# Altium schematic sheet Relay_Interface.SchDoc
size A3; DocumentNumber: 7; SheetNumber: 7; SheetTotal: 11
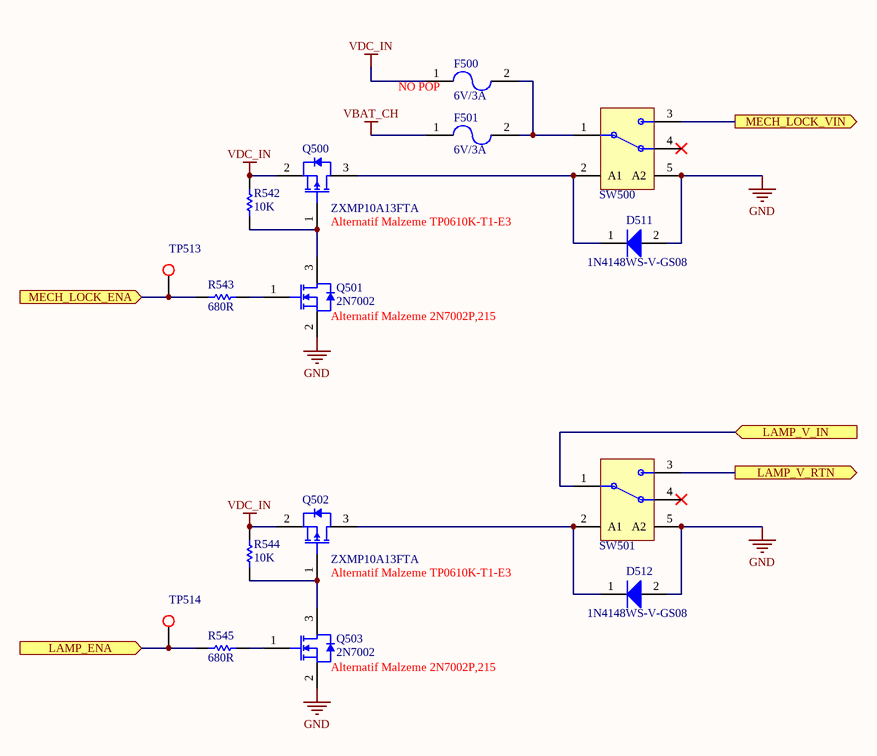
[diagram p0: Relay_Interface.SchDoc]

## Parts
D511  1N4148WS-V-GS08  [SOD65P270X115-2N]
D512  1N4148WS-V-GS08  [SOD65P270X115-2N]
F500  Assembly: NO POP  [AE12-000L-S000-9300]  (hidden comment: 6V/3A)
F501  6V/3A  [AE12-000L-S000-9300]
Q500  ZXMP10A13FTA  [SOT95P230X110-3N]
Q501  2N7002  [SOT90P247X115-3N]
Q502  ZXMP10A13FTA  [SOT95P230X110-3N]
Q503  2N7002  [SOT90P247X115-3N]
R542  10K  [RESC2012X07N]
R543  680R  [RESC1005X04N]
R544  10K  [RESC2012X07N]
R545  680R  [RESC1005X04N]
SW500  Relay  [AE11-0100-T000-0100]  (value not drawn)
SW501  Relay  [AE11-0100-T000-0100]  (value not drawn)
TP513  AEMT-C00S-1000-0000  [TP100]  (value not drawn)
TP514  AEMT-C00S-1000-0000  [TP100]  (value not drawn)

## Ports
LAMP_ENA (in), LAMP_V_IN (in), LAMP_V_RTN (out), MECH_LOCK_ENA (in), MECH_LOCK_VIN (out)

## Nets
GND: D511.2(A) D512.2(A) Q501.2(Source) Q503.2(Source) SW500.5(A2) SW501.5(A2)
VBAT_CH: F501.1
VDC_IN: F500.1 Q500.2(Source) Q502.2(Source) R542.1 R544.1
LAMP_ENA: R545.2 TP514.1 ; port LAMP_ENA
LAMP_V_IN: SW501.1 ; port LAMP_V_IN
LAMP_V_RTN: SW501.3 ; port LAMP_V_RTN
MECH_LOCK_ENA: R543.2 TP513.1 ; port MECH_LOCK_ENA
MECH_LOCK_VIN: SW500.3 ; port MECH_LOCK_VIN
NetD511_1: D511.1(K) Q500.3(Drain) SW500.2(A1)
NetD512_1: D512.1(K) Q502.3(Drain) SW501.2(A1)
NetF500_2: F500.2 F501.2 SW500.1
NetQ500_1: Q500.1(Gate) Q501.3(Drain) R542.2
NetQ501_1: Q501.1(Gate) R543.1
NetQ502_1: Q502.1(Gate) Q503.3(Drain) R544.2
NetQ503_1: Q503.1(Gate) R545.1

Not connected (* = marked no-connect by the designer): SW500 4*; SW501 4*

## Notes on the sheet
- (near Q500) Alternatif Malzeme TP0610K-T1-E3
- (near Q501) Alternatif Malzeme 2N7002P,215
- (near Q502) Alternatif Malzeme TP0610K-T1-E3
- (near Q503) Alternatif Malzeme 2N7002P,215
- Title
- Size:
- Date:
- A3
- Number:
- Time:
- Revision:
- Sheet
- of
- File:

## Library data of the parts
D511 D512 = AS1D-815M-SI10-0000: Diode, Switching, 1.2V @100mA, 75V, SOD-323; Manufacturer: VISHAY; CR: 000104; Lead Finish: Pb Free; Published by: MU; Requested by: TK; Price: *; Manufacturer Part Number: 1N4148WS-V-GS08; DS: 000104; Definition Date: 08.10.2012; Footprint Type: SMD; JEDEC Code: *; Operating Temp: -55 to 150 C; Package Reference: SOD-323; Revision Date: 17.04.2013; Status: Active; Storage Temp: -65 to 150 C; Supplier: *; Supplier Part Number: *; Component Type: DIODE; Forward Voltage: 1.2V @100mA; Reverse Voltage: 75V; Value: 1N4148WS-V-GS08
F500 F501 = AE12-000L-S000-9300: Resettable Fuse, 6V, 3A, SMD, 1812; Manufacturer: TE Connectivity; Manufacturer Part Number: miniSMDC300F; DS: 000256; Published By: MU; Requested By: MAY; CR: *; Definition Date: 06.05.2013; Operating Temp: -40 °C to +85 °C; Footprint Type: SMD; Revision: *; Revision Date: 09.05.2013; Lead Finish: *; Status: Active; Storage Temp: -40 °C to +85 °C; Component Type: Fuse; JEDEC Code: *; Package Reference: EIA 1812, Metric 4532; Price: *; Supplier: *; Supplier Part Number: *; Current Rating: 3A; Max. Operating Voltage: 6V; Value: 6V/3A
Q500 Q502 = AS27-870H-SI20-0000: Transistor, MOSFET, P, 100V, -0.7A, 1R @-10V, ZXMP10A13FTA, SOT23; Manufacturer: Diodes; CR: 000214/92; DS: 000214; Lead Finish: Pb Free; Published by: MU; Requested by: OO; Vgs(max): +-20V; Price: *; Manufacturer Part Number: ZXMP10A13FTA; Definition Date: 18.02.2013; Footprint Type: SMD; JEDEC Code: *; Operating Temp: -55 to 150 C; Package Reference: SOT23; Revision Date: *; Status: Active; Storage Temp: -55 to 150 C; Supplier: *; Supplier Part Number: *; Component Type: TRS/MOSFET; Vds(max): 100V; Id: -0.7A; Value: ZXMP10A13FTA
Q501 Q503 = AS26-810M-SI20-0000: Transistor, MOSFET, N, 60V, 115mA, 2N7002, SOT23; Manufacturer: Fairchild; CR: 000338; DS: 000368; JEDEC Code: TO-236AB; Lead Finish: Pb Free; Published by: MU; Requested by: MAY; Vgs(max): +-20V; Price: *; Manufacturer Part Number: 2N7002; Definition Date: 27.01.2014; Footprint Type: SMD; Operating Temp: -55 to 150 C; Package Reference: SOT23; Revision Date: *; Status: Active; Storage Temp: -55 to 150 C; Supplier: *; Supplier Part Number: *; Component Type: TRS/MOSFET; Vds(max): 60V; Id: 115mA; Value: 2N7002
R542 R544 = AR19-4100-S4B2-0000: RES, E24, Thick Film, SMD, 10K, 1%, 0.125W, 0805; Manufacturer: Panasonic; Manufacturer Part Number: ERJ-6ENF1002V; CR: 000073; Requested by: OO; Lead Finish: Pb Free; Published by: MU; Max. Operating Voltage: 150V; Definition Date: 16.02.2013; Revision Date: *; Price: *; Supplier: *; Supplier Part Number: *; DS: 000073; Operating Temp: -55 to 155 C; Storage Temp: -55 to 155 C; Status: Active; Package Reference: EIA 0805, Metric 2012; Component Type: Resistor; Footprint Type: SMD; JEDEC Code: *; Material: Thick Film; ESR: *; FR: *; Power Rating: 0.125W; Value: 10K
R543 R545 = AR19-2680-S2B2-0000: RES, E24, Thick Film, SMD, 680R, 1%, 0.1W, 0402; Manufacturer: Panasonic; Manufacturer Part Number: ERJ-2RKF6800X; CR: DS00073; Requested by: MU; Lead Finish: Pb Free; Max. Operating Voltage: 50V; Definition Date: 16.08.2012; Revision Date: *; Price: *; Supplier: *; Supplier Part Number: *; DS: DS00073; Operating Temp: -55 to 155 C; Storage Temp: -55 to 155 C; Status: Active; Package Reference: EIA 0402, Metric 1005; Component Type: Resistor; Footprint Type: SMD; Published by: MU; JEDEC Code: *; Material: Thick Film; ESR: *; FR: *; Power Rating: 0.1W; Value: 680R
SW500 SW501 = AE11-0100-T000-0100: Relay, Single Form A, 24VDC, 10A, TH; Manufacturer: Omron; Manufacturer Part Number: G5LE-1A4 DC24; Published By: NK; Current Rating: 10; Max. Operating Voltage: 24; CR: -; DS: -; Definition Date: 23.07.2015; Height: 19; Operating Temp: -40 °C to +85 °C; Footprint Type: TH; Revision: *; Revision Date: *; Lead Finish: *; Status: Active; Storage Temp: -40 °C to +85 °C; Component Type: Relay; JEDEC Code: *; Package Reference: *; Price: *; Requested By: NK; Supplier: *; Supplier Part Number: *; Value: Relay
TP513 TP514 = AEMT-C00S-1000-0000: Test Point, Circular, 1mm; Text: TEST_POINT